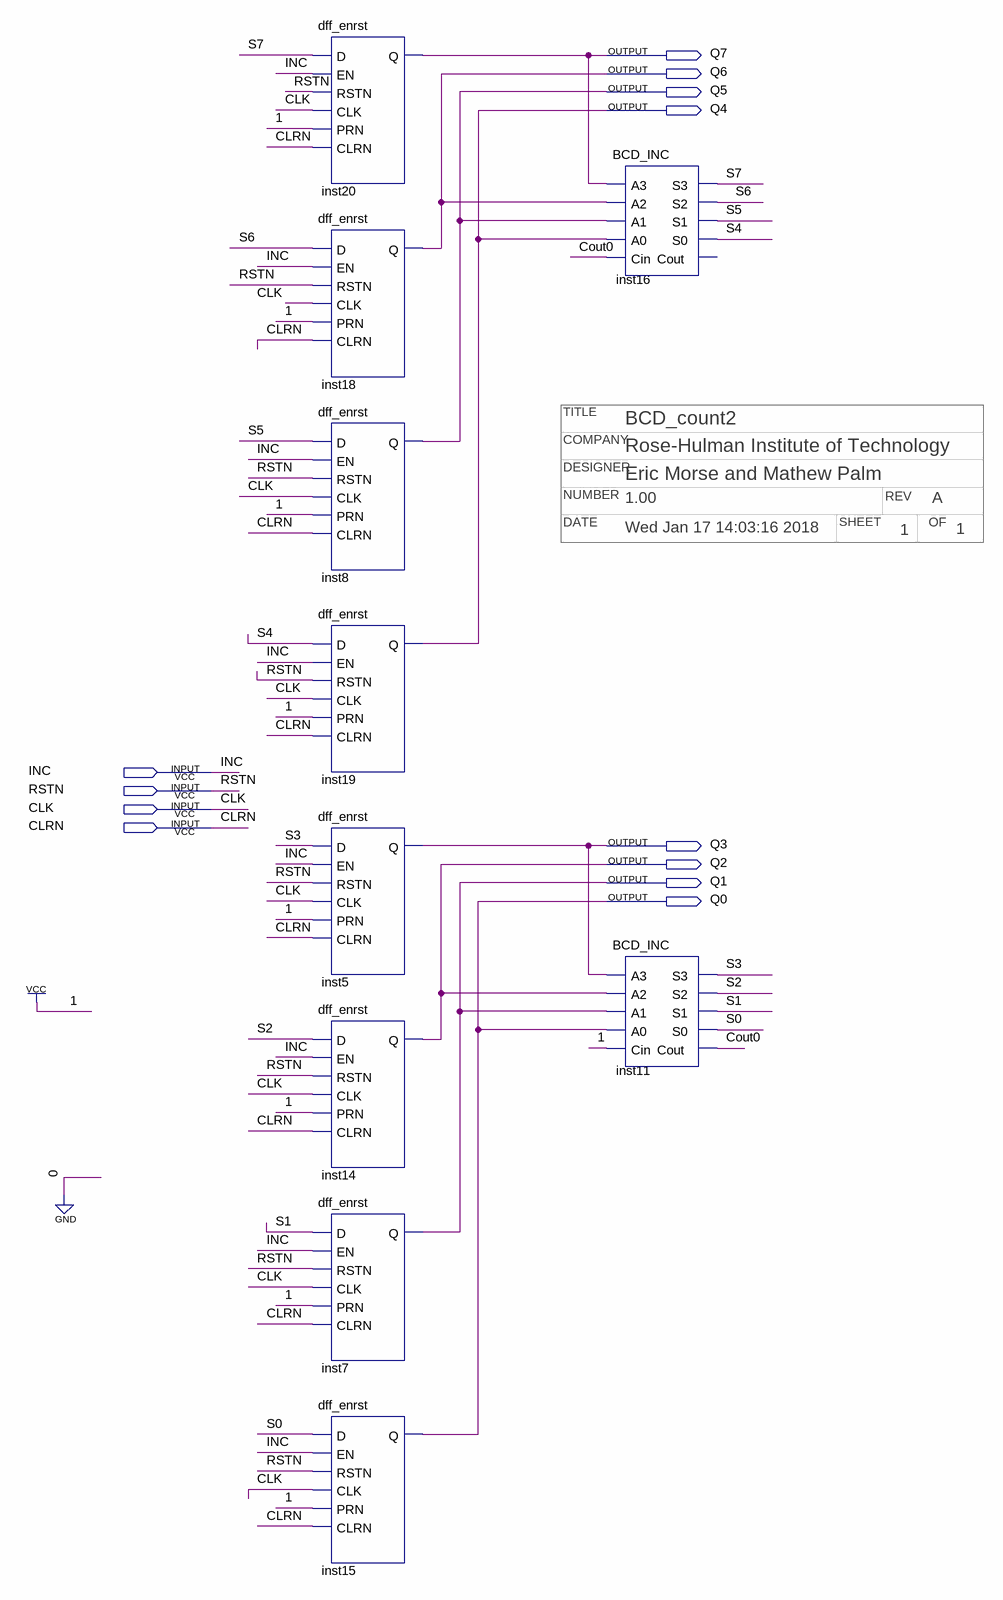
[diagram p0: schematic sheet]
// Quartus schematic bcd_count2.bdf as structural Verilog: 10 symbols, 12 pins
// Title block: COMPANY: Rose-Hulman Institute of Technology; DATE: Wed Jan 17 14:03:16 2018; DESIGNER: Eric Morse and Mathew Palm; NUMBER: 1.00; OF: 1; REV: A; SHEET: 1; TITLE: BCD_count2
module bcd_count2 (
  input  INC,
  input  RSTN,
  input  CLK,
  input  CLRN,
  output Q7,
  output Q6,
  output Q5,
  output Q4,
  output Q3,
  output Q2,
  output Q1,
  output Q0
);

  wire Cout0, S0, S1, S2, S3, S4, S5, S6, S7;

  dff_enrst inst20 (.D(S7), .EN(INC), .RSTN(RSTN), .CLK(CLK), .PRN(1'b1), .CLRN(CLRN), .Q(Q7));
  dff_enrst inst18 (.D(S6), .EN(INC), .RSTN(RSTN), .CLK(CLK), .PRN(1'b1), .CLRN(CLRN), .Q(Q6));
  dff_enrst inst8 (.D(S5), .EN(INC), .RSTN(RSTN), .CLK(CLK), .PRN(1'b1), .CLRN(CLRN), .Q(Q5));
  dff_enrst inst19 (.D(S4), .EN(INC), .RSTN(RSTN), .CLK(CLK), .PRN(1'b1), .CLRN(CLRN), .Q(Q4));
  dff_enrst inst5 (.D(S3), .EN(INC), .RSTN(RSTN), .CLK(CLK), .PRN(1'b1), .CLRN(CLRN), .Q(Q3));
  dff_enrst inst14 (.D(S2), .EN(INC), .RSTN(RSTN), .CLK(CLK), .PRN(1'b1), .CLRN(CLRN), .Q(Q2));
  dff_enrst inst7 (.D(S1), .EN(INC), .RSTN(RSTN), .CLK(CLK), .PRN(1'b1), .CLRN(CLRN), .Q(Q1));
  dff_enrst inst15 (.D(S0), .EN(INC), .RSTN(RSTN), .CLK(CLK), .PRN(1'b1), .CLRN(CLRN), .Q(Q0));
  BCD_INC inst16 (.A3(Q7), .A2(Q6), .A1(Q5), .A0(Q4), .Cin(Cout0), .S3(S7), .S2(S6), .S1(S5), .S0(S4));  // open: Cout
  BCD_INC inst11 (.A3(Q3), .A2(Q2), .A1(Q1), .A0(Q0), .Cin(1'b1), .S3(S3), .S2(S2), .S1(S1), .S0(S0), .Cout(Cout0));
endmodule
